# Altium schematic sheet Display.SchDoc
size A4; SheetNumber: 4; SheetTotal: 6
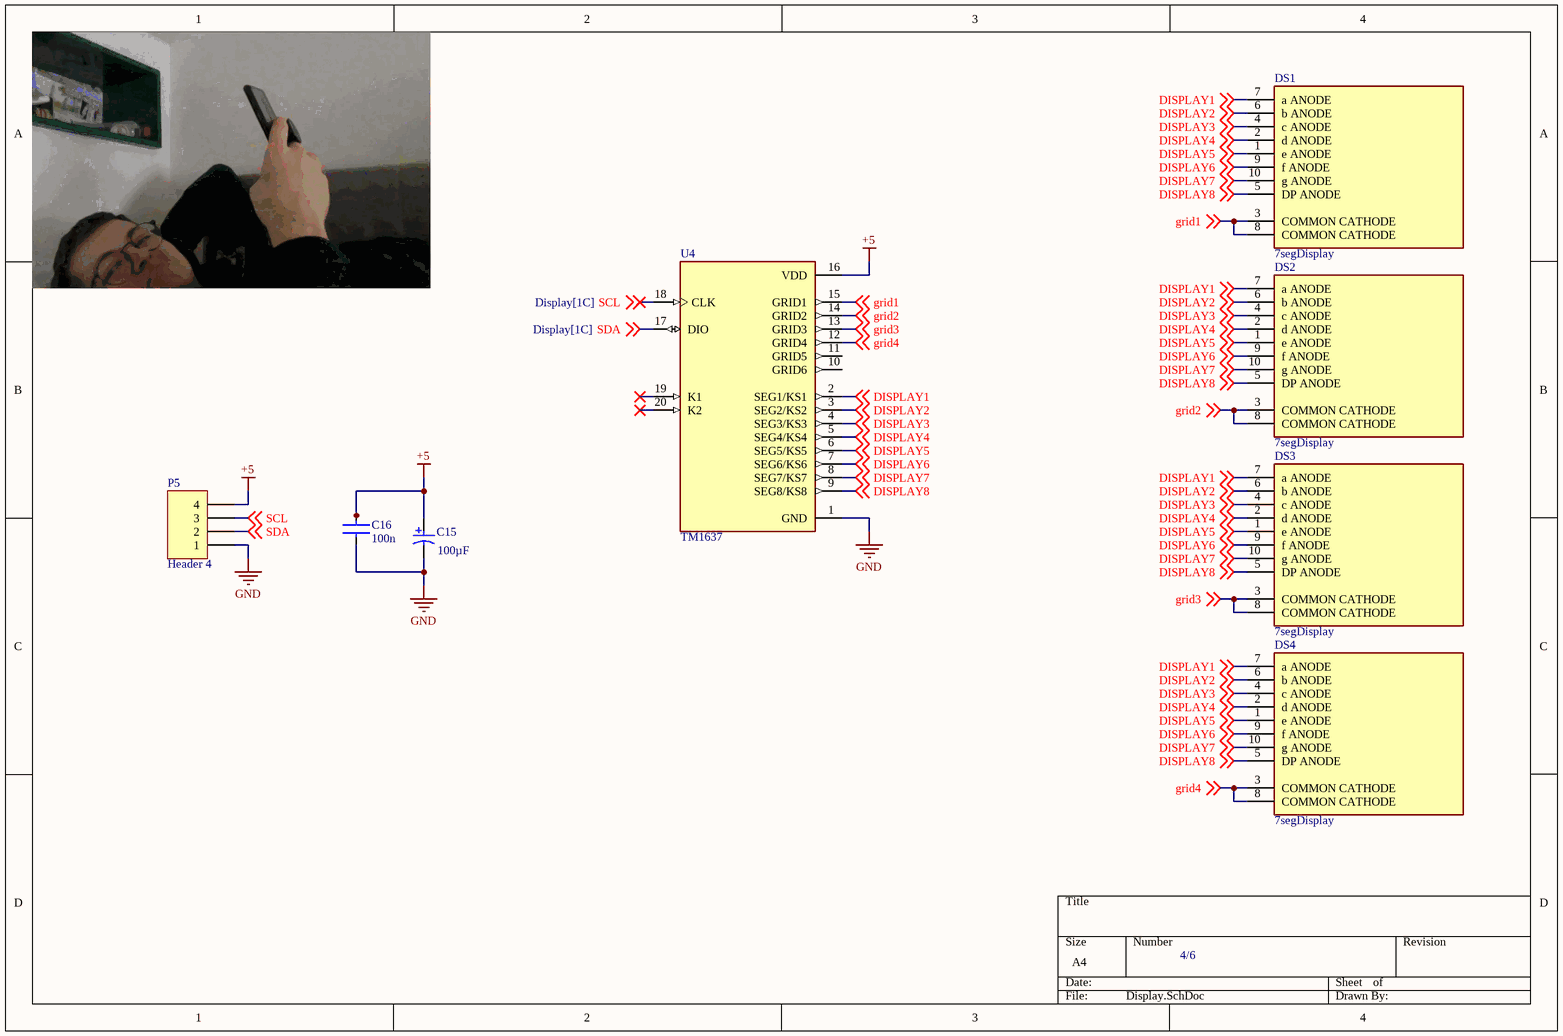
[diagram p0: Display.SchDoc]

## Parts
C15  100µF  [CAP-SMD_BD8.0-L8.3-W8.3-FD]
C16  100n  [RESC2013X50X30LL20T20]
DS1  7segDisplay  [FP-ACSC02-41SURKWA-F01-MFG]
DS2  7segDisplay  [FP-ACSC02-41SURKWA-F01-MFG]
DS3  7segDisplay  [FP-ACSC02-41SURKWA-F01-MFG]
DS4  7segDisplay  [FP-ACSC02-41SURKWA-F01-MFG]
P5  Header 4  [HDR1X4]
U4  TM1637  [SOP_20_M]

## Nets
+5: C15.1(+) C16.1 P5.4 U4.16(VDD)
GND: C15.2(-) C16.2 P5.1 U4.1(GND)
DISPLAY1: DS1.7(a_ANODE) DS2.7(a_ANODE) DS3.7(a_ANODE) DS4.7(a_ANODE) U4.2(SEG1/KS1) ; off-sheet DISPLAY1
DISPLAY2: DS1.6(b_ANODE) DS2.6(b_ANODE) DS3.6(b_ANODE) DS4.6(b_ANODE) U4.3(SEG2/KS2) ; off-sheet DISPLAY2
DISPLAY3: DS1.4(c_ANODE) DS2.4(c_ANODE) DS3.4(c_ANODE) DS4.4(c_ANODE) U4.4(SEG3/KS3) ; off-sheet DISPLAY3
DISPLAY4: DS1.2(d_ANODE) DS2.2(d_ANODE) DS3.2(d_ANODE) DS4.2(d_ANODE) U4.5(SEG4/KS4) ; off-sheet DISPLAY4
DISPLAY5: DS1.1(e_ANODE) DS2.1(e_ANODE) DS3.1(e_ANODE) DS4.1(e_ANODE) U4.6(SEG5/KS5) ; off-sheet DISPLAY5
DISPLAY6: DS1.9(f_ANODE) DS2.9(f_ANODE) DS3.9(f_ANODE) DS4.9(f_ANODE) U4.7(SEG6/KS6) ; off-sheet DISPLAY6
DISPLAY7: DS1.10(g_ANODE) DS2.10(g_ANODE) DS3.10(g_ANODE) DS4.10(g_ANODE) U4.8(SEG7/KS7) ; off-sheet DISPLAY7
DISPLAY8: DS1.5(DP_ANODE) DS2.5(DP_ANODE) DS3.5(DP_ANODE) DS4.5(DP_ANODE) U4.9(SEG8/KS8) ; off-sheet DISPLAY8
grid1: DS1.3(COMMON_CATHODE) DS1.8(COMMON_CATHODE) U4.15(GRID1) ; off-sheet grid1
grid2: DS2.3(COMMON_CATHODE) DS2.8(COMMON_CATHODE) U4.14(GRID2) ; off-sheet grid2
grid3: DS3.3(COMMON_CATHODE) DS3.8(COMMON_CATHODE) U4.13(GRID3) ; off-sheet grid3
grid4: DS4.3(COMMON_CATHODE) DS4.8(COMMON_CATHODE) U4.12(GRID4) ; off-sheet grid4
SCL: P5.3 U4.18(CLK) ; off-sheet SCL
SDA: P5.2 U4.17(DIO) ; off-sheet SDA

Not connected (* = marked no-connect by the designer): U4 10(GRID6) 11(GRID5) 19(K1)* 20(K2)*

## Library data of the parts
C15 = Electrolytic capacitor: Manufacturer: Panasonic; Voltage Rating: 25 V; ComponentLink2URL: http://industrial.panasonic.com/cdbs/www-data/pdf/RDE0000/ABA0000C1181.pdf; Height: 10.2 mm; Max Operating Temperature: 105 degC; PackageReference: EEE-FK1E221P; ComponentLink1Description: Manufacturer URL; ComponentLink1URL: http://www.panasonic.com/; Mount: Surface Mount; REACH SVHC: No SVHC; Min Operating Temperature: -55 degC; ComponentLink2Description: Datasheet; DatasheetVersion: 03/2016; Length: 10.2 mm; RoHSCompliant: true; Packaging: Tape and Reel; Package Quantity: 500; Lead Pitch: 3.1 mm; Pins: 2; PackageDescription: 2-Pin Electrolytic Aluminum Capacitor, Body 8.3 x 8.3 mm; Mounting Technology: Surface Mount
C16 = Capacitor: Voltage Rating (DC): 6.3V; Dielectric: X5R; Capacitance: 10uF; Material: Ceramic; Tolerance: 20%; Packaging: Tape and Reel; Width: 0.031inch; Termination: SMD/SMT; Package Quantity: 4000; Voltage Rating: 6.3V; Case/Package: 0603; Min Operating Temperature: -55°C; Voltage: 6.3V; Length: 1.6mm; Thickness: 0.035inch; Lead Free: Lead Free; Depth: 0.8mm; Case Code (Imperial): 0603; Max Operating Temperature: 85°C; Height: 0.8mm; Mount: Surface Mount; REACH SVHC: No SVHC; Radiation Hardening: No; Case Code (Metric): 1608
DS1-DS4 = 7segDisplay: DISPLAY 7-SEG 0.2" SGL RED 10SMD; Element Configuration: Common Cathode; Operating Supply Voltage: 1.95V; Wavelength: 630nm; Power Consumption: 75mW; Number of Characters: 1; Forward Current: 30mA; Test Current: 20mA; Luminous Intensity: 30mcd; Min Operating Temperature: -40°C; Package Quantity: 650; Height: 0.315inch; Packaging: Tape and Reel; Width: 0.272inch; Max Power Dissipation: 75mW; Color: Red; Illumination Color: Red; Lead Free: Lead Free; Case/Package: SMD/SMT; Max Operating Temperature: 85°C; Forward Voltage: 1.95V
P5 = Header 4: Header, 4-Pin; LatestRevisionDate: 17-Jul-2002; LatestRevisionNote: Re-released for DXP Platform.; Publisher: Altium Limited
U4 = TM1637: LED Drive Control Special Circuit; MF: Titan Micro Electronics; Package: Package; Availability: Not in stock; SnapEDA_Link: https://www.snapeda.com/parts/TM1637/Titan+Micro+Electronics/view-part/?ref=snap; MP: TM1637; Check_prices: https://www.snapeda.com/parts/TM1637/Titan+Micro+Electronics/view-part/?ref=eda; Value: *; Price: None